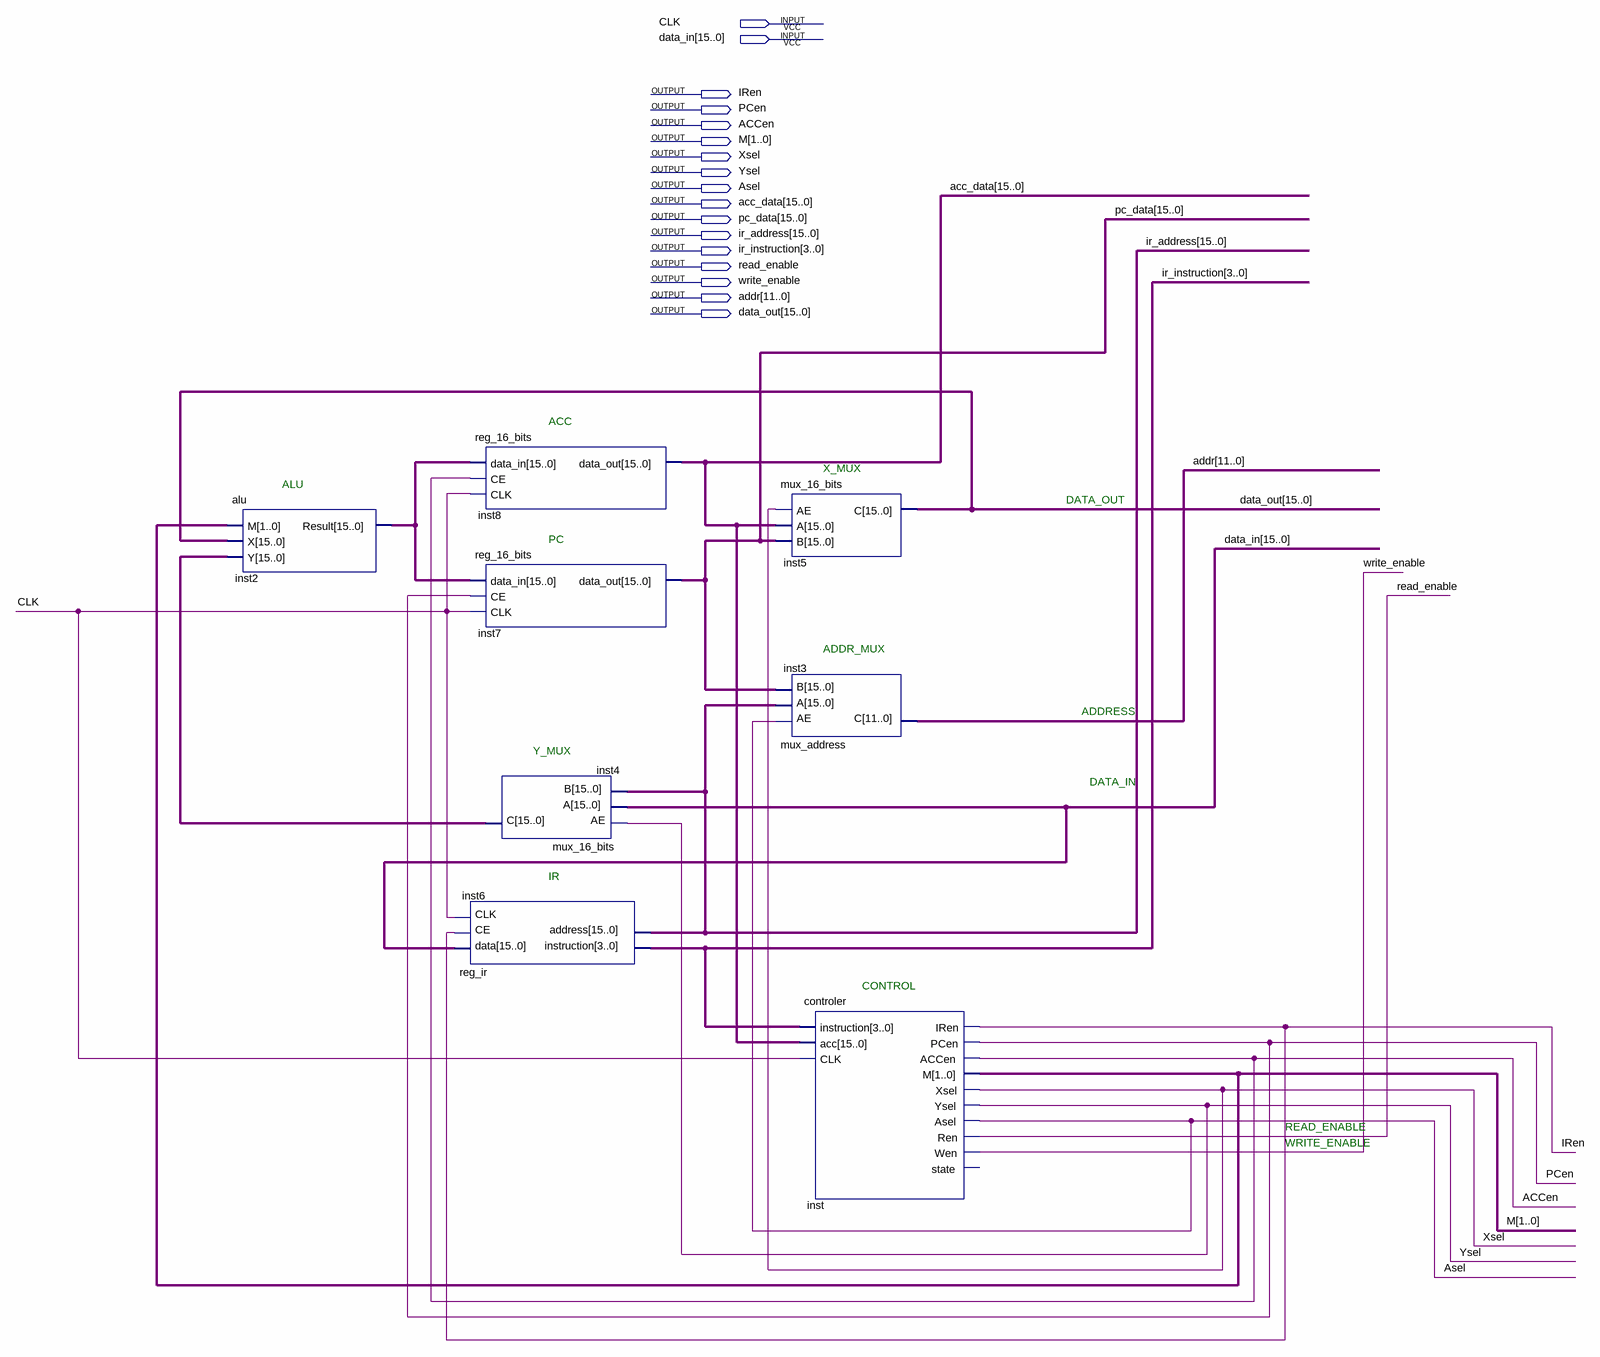
[diagram p0: schematic sheet]
// Quartus schematic cpu.bdf as structural Verilog: 8 symbols, 17 pins
module cpu (
  input  CLK,
  input  [15:0] data_in,
  output IRen,
  output PCen,
  output ACCen,
  output [1:0] M,
  output Xsel,
  output Ysel,
  output Asel,
  output [15:0] acc_data,
  output [15:0] pc_data,
  output [15:0] ir_address,
  output [3:0] ir_instruction,
  output read_enable,
  output write_enable,
  output [11:0] addr,
  output [15:0] data_out
);

  wire [15:0] inst2_result, inst4_c;

  alu inst2 (.M(M), .X(data_out), .Y(inst4_c), .Result(inst2_result));
  reg_ir inst6 (.data(data_in), .CE(IRen), .CLK(CLK), .instruction(ir_instruction), .address(ir_address));
  reg_16_bits inst8 (.data_in(inst2_result), .CE(ACCen), .CLK(CLK), .data_out(acc_data));
  reg_16_bits inst7 (.data_in(inst2_result), .CE(PCen), .CLK(CLK), .data_out(pc_data));
  mux_16_bits inst4 (.AE(Ysel), .A(data_in), .B(ir_address), .C(inst4_c));
  mux_16_bits inst5 (.AE(Xsel), .A(acc_data), .B(pc_data), .C(data_out));
  mux_address inst3 (.AE(Asel), .A(ir_address), .B(pc_data), .C(addr));
  controler inst (
    .instruction(ir_instruction), .acc(acc_data), .CLK(CLK), .IRen(IRen), .PCen(PCen), .ACCen(ACCen), .M(M),
    .Xsel(Xsel), .Ysel(Ysel), .Asel(Asel), .Ren(read_enable), .Wen(write_enable));  // open: state

  // Notes on the sheet:
  //   ACC
  //   X_MUX
  //   ALU
  //   DATA_OUT
  //   PC
  //   ADDR_MUX
  //   ADDRESS
  //   Y_MUX
  //   DATA_IN
  //   IR
  //   CONTROL
  //   READ_ENABLE
  //   WRITE_ENABLE
endmodule
